# EasyEDA schematic Exi-Schematic01.json
TITLE: Sheet_1; REV: 1.0; Date: 2024-01-02; Sheet: 1/1; Company: Your Company
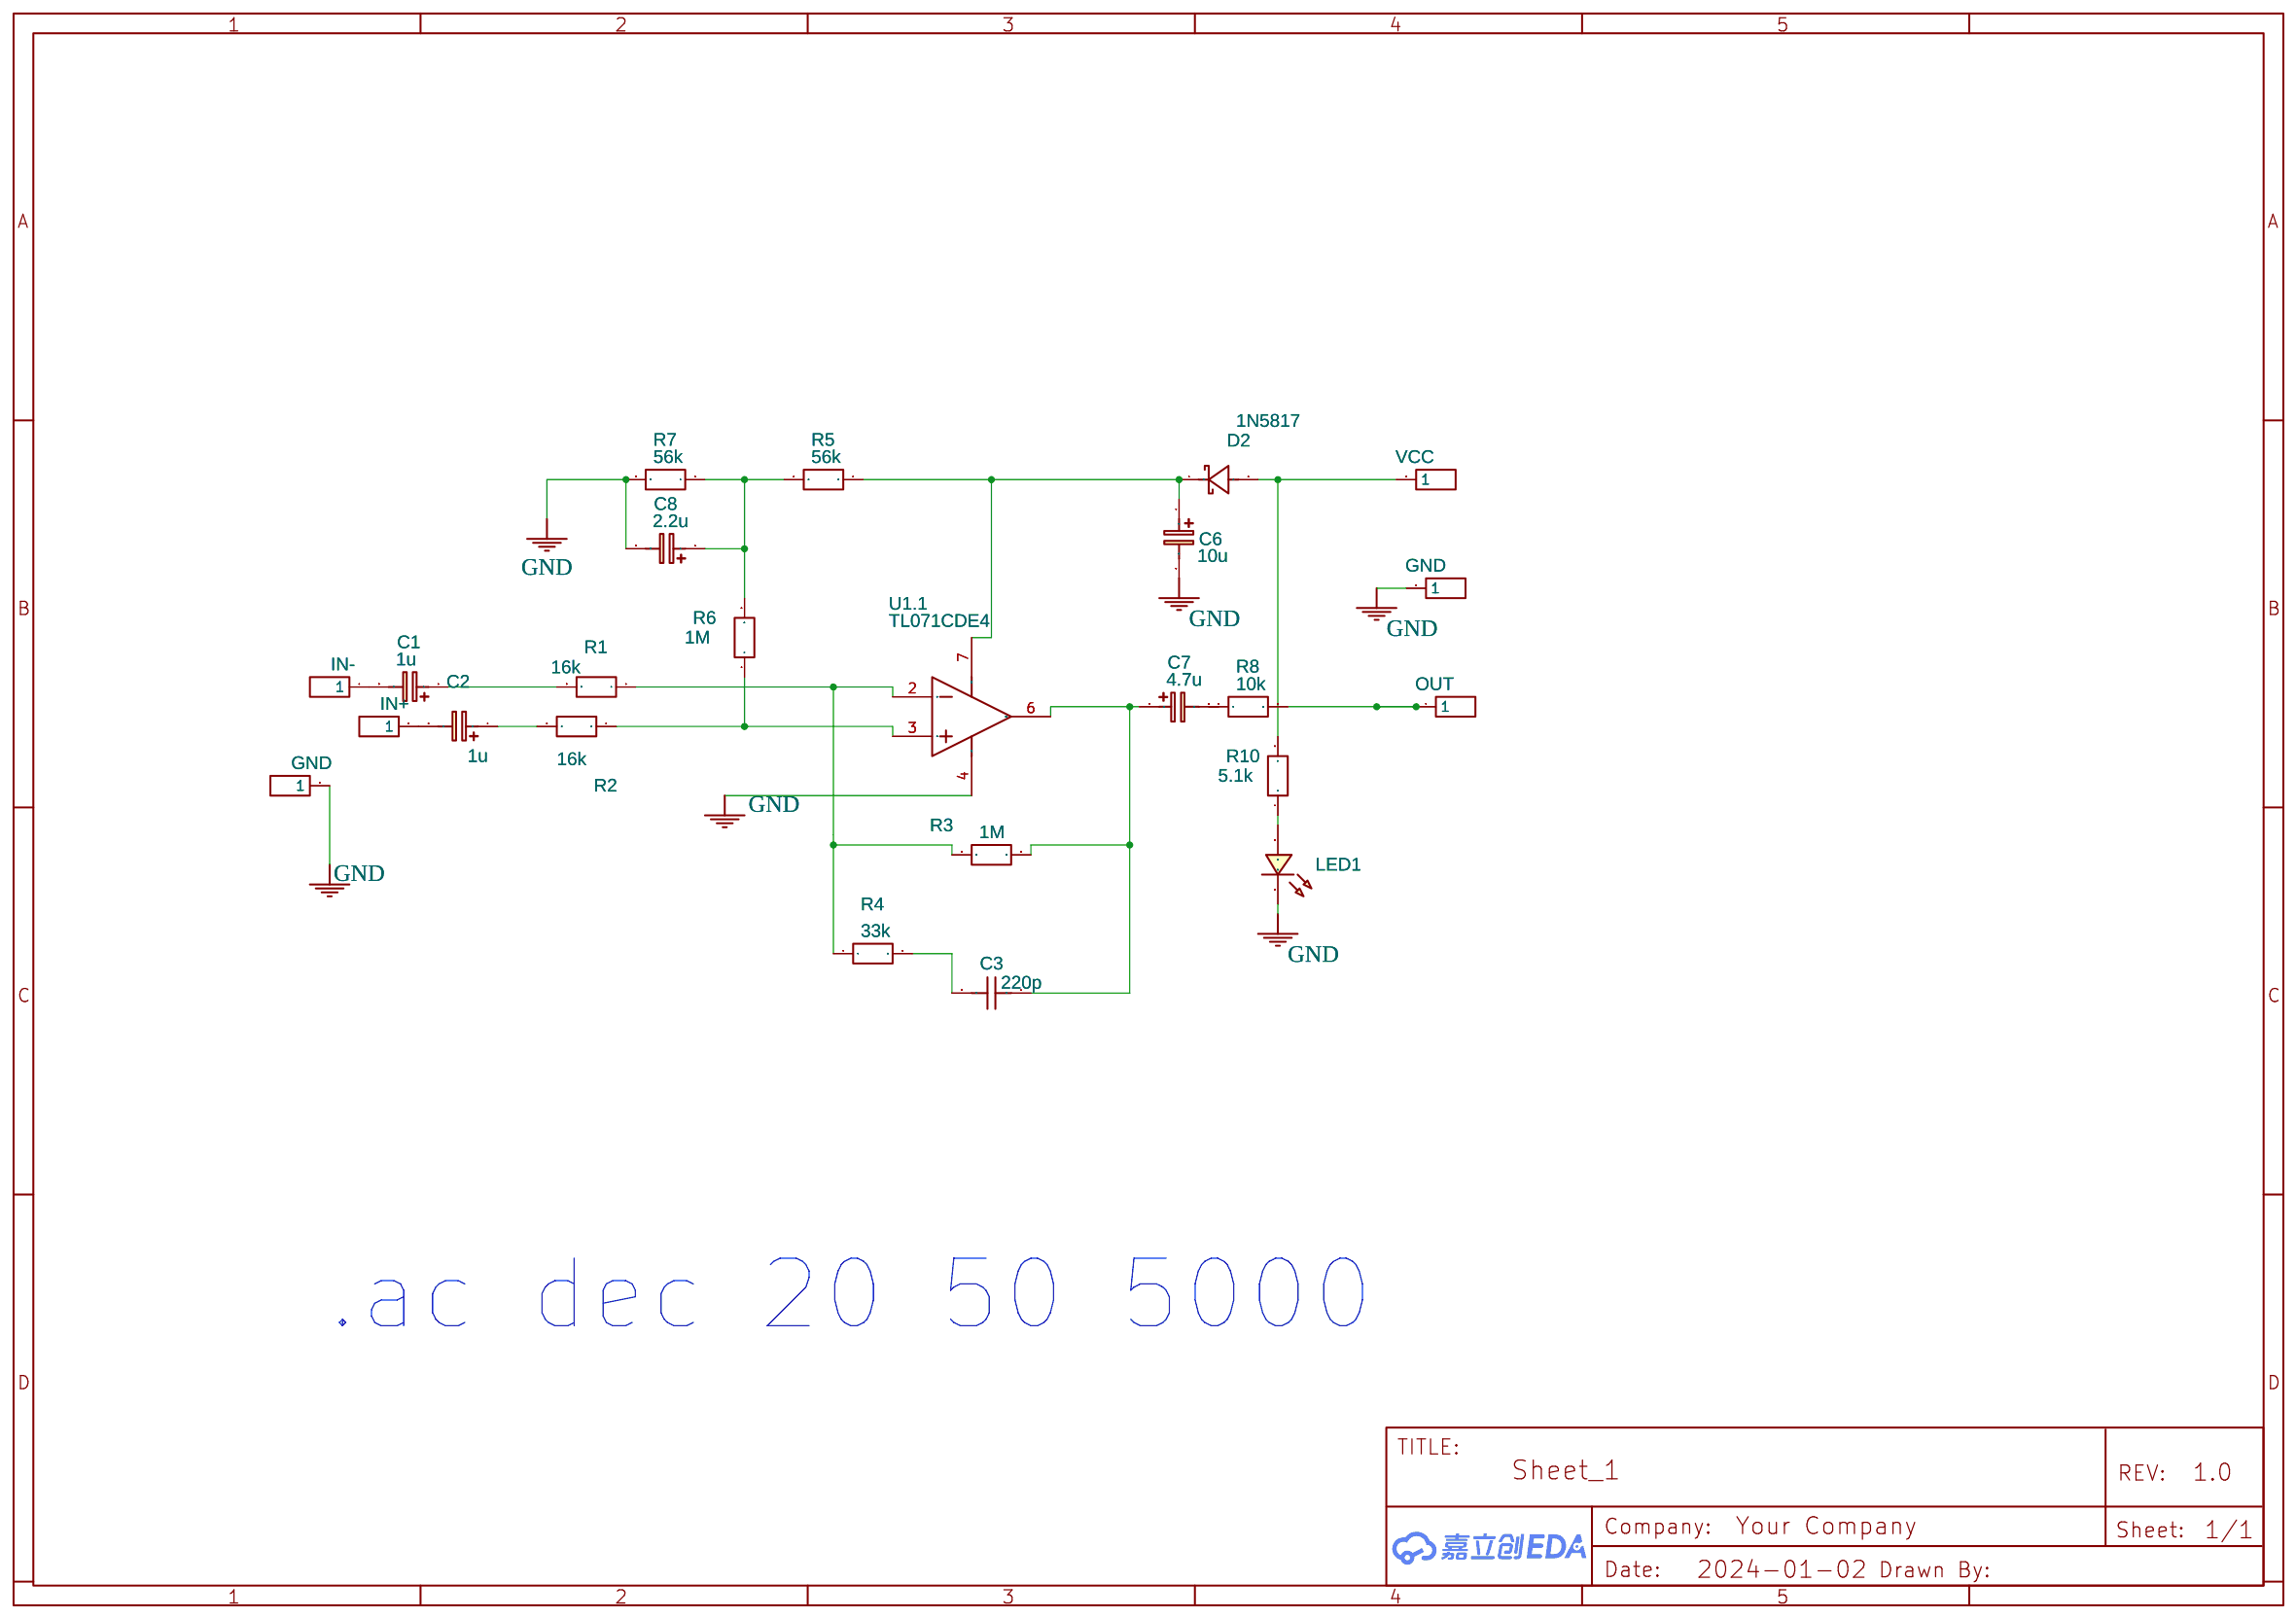
[diagram p0: schematic sheet]

## Parts
C1  1u  [CAP-6.3*12]
C2  1u  [CAP-6.3*8]
C3  220p  [RAD-0.2]
C6  10u  [CAP-6.3*12]
C7  4.7u  [CAP-6.3*8]
C8  2.2u  [CAP-6.3*11]
D2  1N5817  [CAP-7.2*2.5]
GND-  GND  [HDR-M-2.54_1X1]
IN+  IN+  [TESTPOINT-SMD_PAD_5.84MM-1.54MM-0.8MM]
IN-  IN-  [TESTPOINT-SMD_PAD_5.84MM-1.54MM-0.8MM]
INGND  GND  [TESTPOINT-SMD_PAD_5.84MM-1.54MM-0.8MM]
LED1  LED-TH-5mm_R  [CAP-4*5.5]
OUT  OUT  [HDR-M-2.54_1X1]
R1  16k  [PS-RES-7.5*3.6]
R2  16k  [PS-RES-7.5*3.6]
R3  1M  [PS-RES-7.5*3.6]
R4  33k  [PS-RES-7.5*3.6]
R5  56k  [PS-RES-7.5*3.6]
R6  1M  [PS-RES-7.5*3.6]
R7  56k  [PS-RES-7.5*3.6]
R8  10k  [PS-RES-7.5*3.6]
R10  5.1k  [PS-RES-7.5*3.6]
U1  TL071CDE4  [LM741-NUTTAPONG]  (section 1)
VCC  VCC  [HDR-M-2.54_1X1]

## Library data of the parts
C1 C2 C6-C8 = C_Tan_SMD_A_EU: Contributor: LCEDA_Lib
C3 = Capacitor_US: Contributor: EasyEDA; Supplier: YUJING; Capacitance: 1u
D2 = DSCHOTTKY: Contributor: LCSC; Supplier: LCSC; Supplier Part: C9900012836; Manufacturer: null; JLCPCB Part Class: Extended Part
GND- IN+ INGND OUT VCC = HDR-M-2.54_1x1: Supplier Part: C81276; Supplier: LCSC; Contributor: LCEDA_Lib
IN- = HDR-M-2.54_1x1: Supplier Part: C81276; Supplier: LCSC; Contributor: LCEDA_Lib; Package Display: No
LED1 = LED-TH-5mm_R: Manufacturer: EVERLIGHT(台湾亿光); Manufacturer Part: 333-2SURD/S530-A3; Supplier Part: C87271; Supplier: LCSC; Contributor: LCEDA_Lib
R1-R8 R10 = R_0603_EU: Contributor: LCEDA_Lib
U1 = TL071CDE4: subpart_no: 1; Supplier: LCSC; Supplier Part: C4370279; Manufacturer: TI(德州仪器)

## Nets
GND: C6.2 C8.2 GND-.1 INGND.1 LED1.2 R7.2 U1.4(VEE)
Net-(C1-1): C1.1 R1.2
Net-(C1-2): C1.2 IN-.1
Net-(C2-1): C2.1 R2.2
Net-(C2-2): C2.2 IN+.1
Net-(C3-1): C3.1 C7.1 R3.2 U1.6(OUT)
Net-(C3-2): C3.2 R4.2
Net-(C6-1): C6.1 D2.1 R5.1 U1.7(VCC)
Net-(C7-2): C7.2 R8.1
Net-(C8-1): C8.1 R5.2 R6.2 R7.1
Net-(D2-2): D2.2 R10.2 VCC.1
Net-(LED1-1): LED1.1 R10.1
Net-(OUT-1): OUT.1 R8.2
Net-(R1-1): R1.1 R3.1 R4.1 U1.2(IN-)
Net-(R2-1): R2.1 R6.1 U1.3(IN+)

## Notes on the sheet
- .ac dec 20 50 5000
